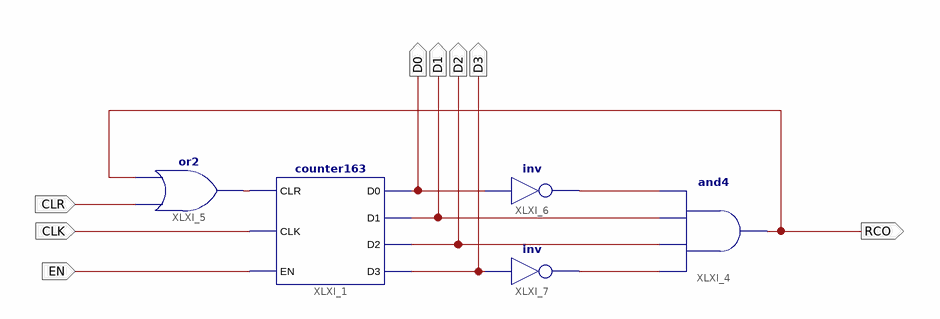
[diagram p0: schematic sheet 1]
// Xilinx ISE schematic mod6.sch (spartan3e) as structural Verilog: 5 symbols, 8 ports
module mod6 (
  input  CLK,
  input  EN,
  input  CLR,
  output D1,
  output D2,
  output RCO,
  output D0,
  output D3
);

  wire XLXN_11, XLXN_13, XLXN_14;

  counter163 XLXI_1 (.CLR(XLXN_11), .CLK(CLK), .EN(EN), .D0(D0), .D1(D1), .D2(D2), .D3(D3));
  and XLXI_4 (RCO, XLXN_13, D2, D1, XLXN_14);
  or XLXI_5 (XLXN_11, CLR, RCO);
  not XLXI_6 (XLXN_14, D0);
  not XLXI_7 (XLXN_13, D3);
endmodule
